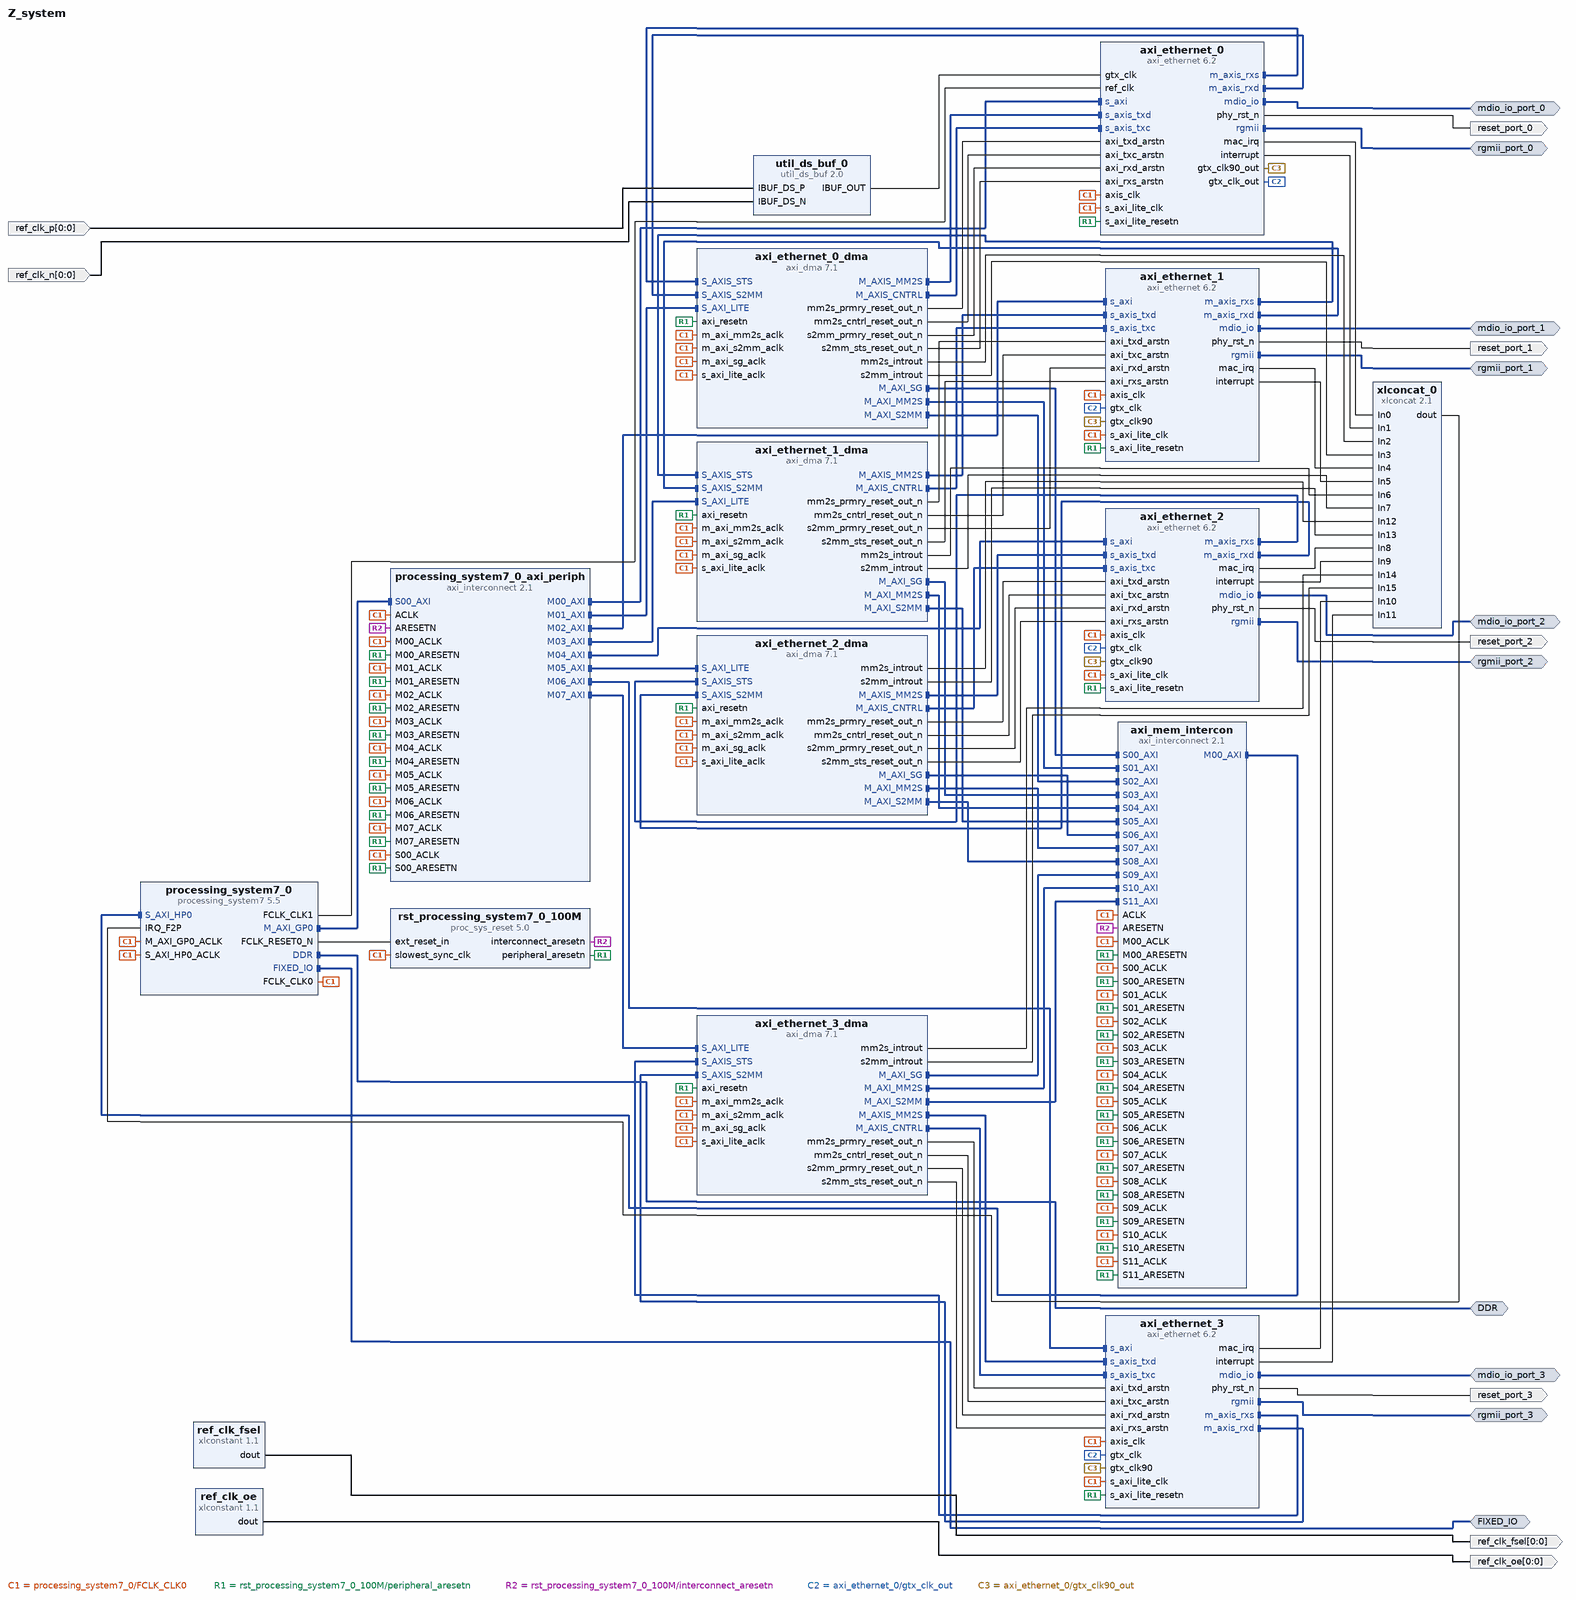
[diagram p0: block diagram of the top level]
# Vivado block design Z_system, Vivado 2014.4
create_bd_design Z_system

create_bd_intf_port -mode Master -vlnv xilinx.com:interface:ddrx_rtl:1.0 DDR
create_bd_intf_port -mode Master -vlnv xilinx.com:display_processing_system7:fixedio_rtl:1.0 FIXED_IO
create_bd_intf_port -mode Master -vlnv xilinx.com:interface:mdio_io:1.0 mdio_io_port_0
create_bd_intf_port -mode Master -vlnv xilinx.com:interface:rgmii_rtl:1.0 rgmii_port_0
create_bd_intf_port -mode Master -vlnv xilinx.com:interface:mdio_io:1.0 mdio_io_port_1
create_bd_intf_port -mode Master -vlnv xilinx.com:interface:rgmii_rtl:1.0 rgmii_port_1
create_bd_intf_port -mode Master -vlnv xilinx.com:interface:mdio_io:1.0 mdio_io_port_2
create_bd_intf_port -mode Master -vlnv xilinx.com:interface:rgmii_rtl:1.0 rgmii_port_2
create_bd_intf_port -mode Master -vlnv xilinx.com:interface:mdio_io:1.0 mdio_io_port_3
create_bd_intf_port -mode Master -vlnv xilinx.com:interface:rgmii_rtl:1.0 rgmii_port_3
create_bd_port -dir I -from 0 -to 0 ref_clk_p
create_bd_port -dir I -from 0 -to 0 ref_clk_n
create_bd_port -dir O -from 0 -to 0 ref_clk_fsel
create_bd_port -dir O -from 0 -to 0 ref_clk_oe
create_bd_port -dir O -type rst reset_port_0
create_bd_port -dir O -type rst reset_port_1
create_bd_port -dir O -type rst reset_port_2
create_bd_port -dir O -type rst reset_port_3

create_bd_cell -type ip -vlnv xilinx.com:ip:util_ds_buf:2.0 util_ds_buf_0
create_bd_cell -type ip -vlnv xilinx.com:ip:xlconstant:1.1 ref_clk_fsel
create_bd_cell -type ip -vlnv xilinx.com:ip:xlconstant:1.1 ref_clk_oe
create_bd_cell -type ip -vlnv xilinx.com:ip:processing_system7:5.5 processing_system7_0
set_property -dict [list \
  CONFIG.PCW_FPGA0_PERIPHERAL_FREQMHZ 100 \
  CONFIG.PCW_FPGA1_PERIPHERAL_FREQMHZ 200 \
  CONFIG.PCW_USE_S_AXI_HP0 1 \
  CONFIG.PCW_USE_FABRIC_INTERRUPT 1 \
  CONFIG.PCW_EN_CLK1_PORT 1 \
  CONFIG.PCW_IRQ_F2P_INTR 1 \
  CONFIG.preset {ZC706*} \
] [get_bd_cells processing_system7_0]
# 1 more settings of processing_system7_0 are not shown: defaults, MIO pin electricals, DDR timing, and values the tool derives
create_bd_cell -type ip -vlnv xilinx.com:ip:axi_ethernet:6.2 axi_ethernet_0
set_property -dict [list \
  CONFIG.USE_BOARD_FLOW true \
  CONFIG.PHY_TYPE RGMII \
  CONFIG.PHYRST_BOARD_INTERFACE Custom \
] [get_bd_cells axi_ethernet_0]
create_bd_cell -type ip -vlnv xilinx.com:ip:axi_dma:7.1 axi_ethernet_0_dma
set_property -dict [list \
  CONFIG.c_sg_length_width 16 \
  CONFIG.c_include_mm2s_dre 1 \
  CONFIG.c_sg_use_stsapp_length 1 \
  CONFIG.c_include_s2mm_dre 1 \
] [get_bd_cells axi_ethernet_0_dma]
create_bd_cell -type ip -vlnv xilinx.com:ip:axi_interconnect:2.1 axi_mem_intercon
set_property -dict {CONFIG.NUM_SI 12 CONFIG.NUM_MI 1} [get_bd_cells axi_mem_intercon]
create_bd_cell -type ip -vlnv xilinx.com:ip:proc_sys_reset:5.0 rst_processing_system7_0_100M
create_bd_cell -type ip -vlnv xilinx.com:ip:axi_interconnect:2.1 processing_system7_0_axi_periph
set_property -dict {CONFIG.NUM_MI 8} [get_bd_cells processing_system7_0_axi_periph]
create_bd_cell -type ip -vlnv xilinx.com:ip:axi_ethernet:6.2 axi_ethernet_1
set_property -dict [list \
  CONFIG.USE_BOARD_FLOW true \
  CONFIG.PHY_TYPE RGMII \
  CONFIG.PHYRST_BOARD_INTERFACE Custom \
  CONFIG.SupportLevel 0 \
] [get_bd_cells axi_ethernet_1]
create_bd_cell -type ip -vlnv xilinx.com:ip:axi_dma:7.1 axi_ethernet_1_dma
set_property -dict [list \
  CONFIG.c_sg_length_width 16 \
  CONFIG.c_include_mm2s_dre 1 \
  CONFIG.c_sg_use_stsapp_length 1 \
  CONFIG.c_include_s2mm_dre 1 \
] [get_bd_cells axi_ethernet_1_dma]
create_bd_cell -type ip -vlnv xilinx.com:ip:axi_ethernet:6.2 axi_ethernet_2
set_property -dict [list \
  CONFIG.USE_BOARD_FLOW true \
  CONFIG.PHY_TYPE RGMII \
  CONFIG.PHYRST_BOARD_INTERFACE Custom \
  CONFIG.SupportLevel 0 \
] [get_bd_cells axi_ethernet_2]
create_bd_cell -type ip -vlnv xilinx.com:ip:axi_dma:7.1 axi_ethernet_2_dma
set_property -dict [list \
  CONFIG.c_sg_length_width 16 \
  CONFIG.c_include_mm2s_dre 1 \
  CONFIG.c_sg_use_stsapp_length 1 \
  CONFIG.c_include_s2mm_dre 1 \
] [get_bd_cells axi_ethernet_2_dma]
create_bd_cell -type ip -vlnv xilinx.com:ip:axi_ethernet:6.2 axi_ethernet_3
set_property -dict [list \
  CONFIG.USE_BOARD_FLOW true \
  CONFIG.PHY_TYPE RGMII \
  CONFIG.PHYRST_BOARD_INTERFACE Custom \
  CONFIG.SupportLevel 0 \
] [get_bd_cells axi_ethernet_3]
create_bd_cell -type ip -vlnv xilinx.com:ip:axi_dma:7.1 axi_ethernet_3_dma
set_property -dict [list \
  CONFIG.c_sg_length_width 16 \
  CONFIG.c_include_mm2s_dre 1 \
  CONFIG.c_sg_use_stsapp_length 1 \
  CONFIG.c_include_s2mm_dre 1 \
] [get_bd_cells axi_ethernet_3_dma]
create_bd_cell -type ip -vlnv xilinx.com:ip:xlconcat:2.1 xlconcat_0
set_property -dict {CONFIG.NUM_PORTS 16} [get_bd_cells xlconcat_0]

# ---- connections ----

connect_bd_intf_net [get_bd_intf_pins axi_ethernet_0_dma/M_AXIS_MM2S] [get_bd_intf_pins axi_ethernet_0/s_axis_txd]
connect_bd_intf_net [get_bd_intf_pins axi_ethernet_0_dma/M_AXIS_CNTRL] [get_bd_intf_pins axi_ethernet_0/s_axis_txc]
connect_bd_intf_net [get_bd_intf_pins axi_ethernet_0_dma/S_AXIS_STS] [get_bd_intf_pins axi_ethernet_0/m_axis_rxs]
connect_bd_intf_net [get_bd_intf_pins axi_ethernet_0_dma/S_AXIS_S2MM] [get_bd_intf_pins axi_ethernet_0/m_axis_rxd]
connect_bd_intf_net [get_bd_intf_pins axi_ethernet_0_dma/M_AXI_SG] [get_bd_intf_pins axi_mem_intercon/S00_AXI]
connect_bd_intf_net [get_bd_intf_pins axi_mem_intercon/M00_AXI] [get_bd_intf_pins processing_system7_0/S_AXI_HP0]
connect_bd_intf_net [get_bd_intf_pins processing_system7_0/M_AXI_GP0] [get_bd_intf_pins processing_system7_0_axi_periph/S00_AXI]
connect_bd_intf_net [get_bd_intf_pins processing_system7_0_axi_periph/M00_AXI] [get_bd_intf_pins axi_ethernet_0/s_axi]
connect_bd_intf_net [get_bd_intf_pins processing_system7_0_axi_periph/M01_AXI] [get_bd_intf_pins axi_ethernet_0_dma/S_AXI_LITE]
connect_bd_intf_net [get_bd_intf_pins axi_ethernet_0_dma/M_AXI_MM2S] [get_bd_intf_pins axi_mem_intercon/S01_AXI]
connect_bd_intf_net [get_bd_intf_pins axi_ethernet_0_dma/M_AXI_S2MM] [get_bd_intf_pins axi_mem_intercon/S02_AXI]
connect_bd_intf_net [get_bd_intf_pins axi_ethernet_1_dma/M_AXIS_MM2S] [get_bd_intf_pins axi_ethernet_1/s_axis_txd]
connect_bd_intf_net [get_bd_intf_pins axi_ethernet_1_dma/M_AXIS_CNTRL] [get_bd_intf_pins axi_ethernet_1/s_axis_txc]
connect_bd_intf_net [get_bd_intf_pins axi_ethernet_1_dma/S_AXIS_STS] [get_bd_intf_pins axi_ethernet_1/m_axis_rxs]
connect_bd_intf_net [get_bd_intf_pins axi_ethernet_1_dma/S_AXIS_S2MM] [get_bd_intf_pins axi_ethernet_1/m_axis_rxd]
connect_bd_intf_net [get_bd_intf_pins processing_system7_0_axi_periph/M02_AXI] [get_bd_intf_pins axi_ethernet_1/s_axi]
connect_bd_intf_net [get_bd_intf_pins processing_system7_0_axi_periph/M03_AXI] [get_bd_intf_pins axi_ethernet_1_dma/S_AXI_LITE]
connect_bd_intf_net [get_bd_intf_pins axi_ethernet_1_dma/M_AXI_SG] [get_bd_intf_pins axi_mem_intercon/S03_AXI]
connect_bd_intf_net [get_bd_intf_pins axi_ethernet_1_dma/M_AXI_MM2S] [get_bd_intf_pins axi_mem_intercon/S04_AXI]
connect_bd_intf_net [get_bd_intf_pins axi_ethernet_1_dma/M_AXI_S2MM] [get_bd_intf_pins axi_mem_intercon/S05_AXI]
connect_bd_intf_net [get_bd_intf_pins axi_ethernet_2_dma/M_AXIS_MM2S] [get_bd_intf_pins axi_ethernet_2/s_axis_txd]
connect_bd_intf_net [get_bd_intf_pins axi_ethernet_2_dma/M_AXIS_CNTRL] [get_bd_intf_pins axi_ethernet_2/s_axis_txc]
connect_bd_intf_net [get_bd_intf_pins axi_ethernet_2_dma/S_AXIS_STS] [get_bd_intf_pins axi_ethernet_2/m_axis_rxs]
connect_bd_intf_net [get_bd_intf_pins axi_ethernet_2_dma/S_AXIS_S2MM] [get_bd_intf_pins axi_ethernet_2/m_axis_rxd]
connect_bd_intf_net [get_bd_intf_pins processing_system7_0_axi_periph/M04_AXI] [get_bd_intf_pins axi_ethernet_2/s_axi]
connect_bd_intf_net [get_bd_intf_pins processing_system7_0_axi_periph/M05_AXI] [get_bd_intf_pins axi_ethernet_2_dma/S_AXI_LITE]
connect_bd_intf_net [get_bd_intf_pins axi_ethernet_2_dma/M_AXI_SG] [get_bd_intf_pins axi_mem_intercon/S06_AXI]
connect_bd_intf_net [get_bd_intf_pins axi_ethernet_2_dma/M_AXI_MM2S] [get_bd_intf_pins axi_mem_intercon/S07_AXI]
connect_bd_intf_net [get_bd_intf_pins axi_ethernet_2_dma/M_AXI_S2MM] [get_bd_intf_pins axi_mem_intercon/S08_AXI]
connect_bd_intf_net [get_bd_intf_pins axi_ethernet_3_dma/M_AXIS_MM2S] [get_bd_intf_pins axi_ethernet_3/s_axis_txd]
connect_bd_intf_net [get_bd_intf_pins axi_ethernet_3_dma/M_AXIS_CNTRL] [get_bd_intf_pins axi_ethernet_3/s_axis_txc]
connect_bd_intf_net [get_bd_intf_pins axi_ethernet_3_dma/S_AXIS_STS] [get_bd_intf_pins axi_ethernet_3/m_axis_rxs]
connect_bd_intf_net [get_bd_intf_pins axi_ethernet_3_dma/S_AXIS_S2MM] [get_bd_intf_pins axi_ethernet_3/m_axis_rxd]
connect_bd_intf_net [get_bd_intf_pins processing_system7_0_axi_periph/M06_AXI] [get_bd_intf_pins axi_ethernet_3/s_axi]
connect_bd_intf_net [get_bd_intf_pins processing_system7_0_axi_periph/M07_AXI] [get_bd_intf_pins axi_ethernet_3_dma/S_AXI_LITE]
connect_bd_intf_net [get_bd_intf_pins axi_ethernet_3_dma/M_AXI_SG] [get_bd_intf_pins axi_mem_intercon/S09_AXI]
connect_bd_intf_net [get_bd_intf_pins axi_ethernet_3_dma/M_AXI_MM2S] [get_bd_intf_pins axi_mem_intercon/S10_AXI]
connect_bd_intf_net [get_bd_intf_pins axi_ethernet_3_dma/M_AXI_S2MM] [get_bd_intf_pins axi_mem_intercon/S11_AXI]
connect_bd_intf_net [get_bd_intf_ports DDR] [get_bd_intf_pins processing_system7_0/DDR]
connect_bd_intf_net [get_bd_intf_ports FIXED_IO] [get_bd_intf_pins processing_system7_0/FIXED_IO]
connect_bd_intf_net [get_bd_intf_ports mdio_io_port_0] [get_bd_intf_pins axi_ethernet_0/mdio_io]
connect_bd_intf_net [get_bd_intf_ports rgmii_port_0] [get_bd_intf_pins axi_ethernet_0/rgmii]
connect_bd_intf_net [get_bd_intf_ports mdio_io_port_1] [get_bd_intf_pins axi_ethernet_1/mdio_io]
connect_bd_intf_net [get_bd_intf_ports rgmii_port_1] [get_bd_intf_pins axi_ethernet_1/rgmii]
connect_bd_intf_net [get_bd_intf_ports mdio_io_port_2] [get_bd_intf_pins axi_ethernet_2/mdio_io]
connect_bd_intf_net [get_bd_intf_ports rgmii_port_2] [get_bd_intf_pins axi_ethernet_2/rgmii]
connect_bd_intf_net [get_bd_intf_ports mdio_io_port_3] [get_bd_intf_pins axi_ethernet_3/mdio_io]
connect_bd_intf_net [get_bd_intf_ports rgmii_port_3] [get_bd_intf_pins axi_ethernet_3/rgmii]
connect_bd_net [get_bd_ports ref_clk_p] [get_bd_pins util_ds_buf_0/IBUF_DS_P]
connect_bd_net [get_bd_ports ref_clk_n] [get_bd_pins util_ds_buf_0/IBUF_DS_N]
connect_bd_net [get_bd_pins ref_clk_fsel/dout] [get_bd_ports ref_clk_fsel]
connect_bd_net [get_bd_pins ref_clk_oe/dout] [get_bd_ports ref_clk_oe]
connect_bd_net [get_bd_pins axi_ethernet_0_dma/mm2s_prmry_reset_out_n] [get_bd_pins axi_ethernet_0/axi_txd_arstn]
connect_bd_net [get_bd_pins axi_ethernet_0_dma/mm2s_cntrl_reset_out_n] [get_bd_pins axi_ethernet_0/axi_txc_arstn]
connect_bd_net [get_bd_pins axi_ethernet_0_dma/s2mm_prmry_reset_out_n] [get_bd_pins axi_ethernet_0/axi_rxd_arstn]
connect_bd_net [get_bd_pins axi_ethernet_0_dma/s2mm_sts_reset_out_n] [get_bd_pins axi_ethernet_0/axi_rxs_arstn]
connect_bd_net [get_bd_pins processing_system7_0/FCLK_CLK0] \
  [get_bd_pins axi_ethernet_0_dma/m_axi_sg_aclk] [get_bd_pins axi_mem_intercon/S00_ACLK] \
  [get_bd_pins rst_processing_system7_0_100M/slowest_sync_clk] [get_bd_pins axi_mem_intercon/ACLK] \
  [get_bd_pins processing_system7_0/S_AXI_HP0_ACLK] [get_bd_pins axi_mem_intercon/M00_ACLK] \
  [get_bd_pins processing_system7_0/M_AXI_GP0_ACLK] [get_bd_pins processing_system7_0_axi_periph/S00_ACLK] \
  [get_bd_pins processing_system7_0_axi_periph/ACLK] [get_bd_pins axi_ethernet_0/s_axi_lite_clk] \
  [get_bd_pins processing_system7_0_axi_periph/M00_ACLK] [get_bd_pins axi_ethernet_0_dma/s_axi_lite_aclk] \
  [get_bd_pins processing_system7_0_axi_periph/M01_ACLK] [get_bd_pins axi_ethernet_0_dma/m_axi_mm2s_aclk] \
  [get_bd_pins axi_ethernet_0_dma/m_axi_s2mm_aclk] [get_bd_pins axi_ethernet_0/axis_clk] \
  [get_bd_pins axi_mem_intercon/S01_ACLK] [get_bd_pins axi_mem_intercon/S02_ACLK] [get_bd_pins axi_ethernet_1/s_axi_lite_clk] \
  [get_bd_pins processing_system7_0_axi_periph/M02_ACLK] [get_bd_pins axi_ethernet_1_dma/s_axi_lite_aclk] \
  [get_bd_pins processing_system7_0_axi_periph/M03_ACLK] [get_bd_pins axi_ethernet_1_dma/m_axi_sg_aclk] \
  [get_bd_pins axi_mem_intercon/S03_ACLK] [get_bd_pins axi_ethernet_1_dma/m_axi_mm2s_aclk] \
  [get_bd_pins axi_ethernet_1_dma/m_axi_s2mm_aclk] [get_bd_pins axi_ethernet_1/axis_clk] \
  [get_bd_pins axi_mem_intercon/S04_ACLK] [get_bd_pins axi_mem_intercon/S05_ACLK] [get_bd_pins axi_ethernet_2/s_axi_lite_clk] \
  [get_bd_pins processing_system7_0_axi_periph/M04_ACLK] [get_bd_pins axi_ethernet_2_dma/s_axi_lite_aclk] \
  [get_bd_pins processing_system7_0_axi_periph/M05_ACLK] [get_bd_pins axi_ethernet_2_dma/m_axi_sg_aclk] \
  [get_bd_pins axi_mem_intercon/S06_ACLK] [get_bd_pins axi_ethernet_2_dma/m_axi_mm2s_aclk] \
  [get_bd_pins axi_ethernet_2_dma/m_axi_s2mm_aclk] [get_bd_pins axi_ethernet_2/axis_clk] \
  [get_bd_pins axi_mem_intercon/S07_ACLK] [get_bd_pins axi_mem_intercon/S08_ACLK] [get_bd_pins axi_ethernet_3/s_axi_lite_clk] \
  [get_bd_pins processing_system7_0_axi_periph/M06_ACLK] [get_bd_pins axi_ethernet_3_dma/s_axi_lite_aclk] \
  [get_bd_pins processing_system7_0_axi_periph/M07_ACLK] [get_bd_pins axi_ethernet_3_dma/m_axi_sg_aclk] \
  [get_bd_pins axi_mem_intercon/S09_ACLK] [get_bd_pins axi_ethernet_3_dma/m_axi_mm2s_aclk] \
  [get_bd_pins axi_ethernet_3_dma/m_axi_s2mm_aclk] [get_bd_pins axi_ethernet_3/axis_clk] \
  [get_bd_pins axi_mem_intercon/S10_ACLK] [get_bd_pins axi_mem_intercon/S11_ACLK]
connect_bd_net [get_bd_pins processing_system7_0/FCLK_RESET0_N] [get_bd_pins rst_processing_system7_0_100M/ext_reset_in]
connect_bd_net [get_bd_pins rst_processing_system7_0_100M/peripheral_aresetn] \
  [get_bd_pins axi_mem_intercon/S00_ARESETN] [get_bd_pins axi_mem_intercon/M00_ARESETN] \
  [get_bd_pins processing_system7_0_axi_periph/S00_ARESETN] [get_bd_pins axi_ethernet_0/s_axi_lite_resetn] \
  [get_bd_pins processing_system7_0_axi_periph/M00_ARESETN] [get_bd_pins axi_ethernet_0_dma/axi_resetn] \
  [get_bd_pins processing_system7_0_axi_periph/M01_ARESETN] [get_bd_pins axi_mem_intercon/S01_ARESETN] \
  [get_bd_pins axi_mem_intercon/S02_ARESETN] [get_bd_pins axi_ethernet_1/s_axi_lite_resetn] \
  [get_bd_pins processing_system7_0_axi_periph/M02_ARESETN] [get_bd_pins axi_ethernet_1_dma/axi_resetn] \
  [get_bd_pins processing_system7_0_axi_periph/M03_ARESETN] [get_bd_pins axi_mem_intercon/S03_ARESETN] \
  [get_bd_pins axi_mem_intercon/S04_ARESETN] [get_bd_pins axi_mem_intercon/S05_ARESETN] \
  [get_bd_pins axi_ethernet_2/s_axi_lite_resetn] [get_bd_pins processing_system7_0_axi_periph/M04_ARESETN] \
  [get_bd_pins axi_ethernet_2_dma/axi_resetn] [get_bd_pins processing_system7_0_axi_periph/M05_ARESETN] \
  [get_bd_pins axi_mem_intercon/S06_ARESETN] [get_bd_pins axi_mem_intercon/S07_ARESETN] \
  [get_bd_pins axi_mem_intercon/S08_ARESETN] [get_bd_pins axi_ethernet_3/s_axi_lite_resetn] \
  [get_bd_pins processing_system7_0_axi_periph/M06_ARESETN] [get_bd_pins axi_ethernet_3_dma/axi_resetn] \
  [get_bd_pins processing_system7_0_axi_periph/M07_ARESETN] [get_bd_pins axi_mem_intercon/S09_ARESETN] \
  [get_bd_pins axi_mem_intercon/S10_ARESETN] [get_bd_pins axi_mem_intercon/S11_ARESETN]
connect_bd_net [get_bd_pins rst_processing_system7_0_100M/interconnect_aresetn] \
  [get_bd_pins axi_mem_intercon/ARESETN] [get_bd_pins processing_system7_0_axi_periph/ARESETN]
connect_bd_net [get_bd_pins axi_ethernet_0/phy_rst_n] [get_bd_ports reset_port_0]
connect_bd_net [get_bd_pins axi_ethernet_1_dma/mm2s_prmry_reset_out_n] [get_bd_pins axi_ethernet_1/axi_txd_arstn]
connect_bd_net [get_bd_pins axi_ethernet_1_dma/mm2s_cntrl_reset_out_n] [get_bd_pins axi_ethernet_1/axi_txc_arstn]
connect_bd_net [get_bd_pins axi_ethernet_1_dma/s2mm_prmry_reset_out_n] [get_bd_pins axi_ethernet_1/axi_rxd_arstn]
connect_bd_net [get_bd_pins axi_ethernet_1_dma/s2mm_sts_reset_out_n] [get_bd_pins axi_ethernet_1/axi_rxs_arstn]
connect_bd_net [get_bd_pins axi_ethernet_1/phy_rst_n] [get_bd_ports reset_port_1]
connect_bd_net [get_bd_pins axi_ethernet_2_dma/mm2s_prmry_reset_out_n] [get_bd_pins axi_ethernet_2/axi_txd_arstn]
connect_bd_net [get_bd_pins axi_ethernet_2_dma/mm2s_cntrl_reset_out_n] [get_bd_pins axi_ethernet_2/axi_txc_arstn]
connect_bd_net [get_bd_pins axi_ethernet_2_dma/s2mm_prmry_reset_out_n] [get_bd_pins axi_ethernet_2/axi_rxd_arstn]
connect_bd_net [get_bd_pins axi_ethernet_2_dma/s2mm_sts_reset_out_n] [get_bd_pins axi_ethernet_2/axi_rxs_arstn]
connect_bd_net [get_bd_pins axi_ethernet_2/phy_rst_n] [get_bd_ports reset_port_2]
connect_bd_net [get_bd_pins axi_ethernet_3_dma/mm2s_prmry_reset_out_n] [get_bd_pins axi_ethernet_3/axi_txd_arstn]
connect_bd_net [get_bd_pins axi_ethernet_3_dma/mm2s_cntrl_reset_out_n] [get_bd_pins axi_ethernet_3/axi_txc_arstn]
connect_bd_net [get_bd_pins axi_ethernet_3_dma/s2mm_prmry_reset_out_n] [get_bd_pins axi_ethernet_3/axi_rxd_arstn]
connect_bd_net [get_bd_pins axi_ethernet_3_dma/s2mm_sts_reset_out_n] [get_bd_pins axi_ethernet_3/axi_rxs_arstn]
connect_bd_net [get_bd_pins axi_ethernet_3/phy_rst_n] [get_bd_ports reset_port_3]
connect_bd_net [get_bd_pins util_ds_buf_0/IBUF_OUT] [get_bd_pins axi_ethernet_0/gtx_clk]
connect_bd_net [get_bd_pins processing_system7_0/FCLK_CLK1] [get_bd_pins axi_ethernet_0/ref_clk]
connect_bd_net [get_bd_pins axi_ethernet_0/gtx_clk_out] \
  [get_bd_pins axi_ethernet_1/gtx_clk] [get_bd_pins axi_ethernet_2/gtx_clk] [get_bd_pins axi_ethernet_3/gtx_clk]
connect_bd_net [get_bd_pins axi_ethernet_0/gtx_clk90_out] \
  [get_bd_pins axi_ethernet_1/gtx_clk90] [get_bd_pins axi_ethernet_2/gtx_clk90] [get_bd_pins axi_ethernet_3/gtx_clk90]
connect_bd_net [get_bd_pins axi_ethernet_0/mac_irq] [get_bd_pins xlconcat_0/In0]
connect_bd_net [get_bd_pins axi_ethernet_0/interrupt] [get_bd_pins xlconcat_0/In1]
connect_bd_net [get_bd_pins axi_ethernet_0_dma/mm2s_introut] [get_bd_pins xlconcat_0/In2]
connect_bd_net [get_bd_pins axi_ethernet_0_dma/s2mm_introut] [get_bd_pins xlconcat_0/In3]
connect_bd_net [get_bd_pins axi_ethernet_1/mac_irq] [get_bd_pins xlconcat_0/In4]
connect_bd_net [get_bd_pins axi_ethernet_1/interrupt] [get_bd_pins xlconcat_0/In5]
connect_bd_net [get_bd_pins axi_ethernet_1_dma/mm2s_introut] [get_bd_pins xlconcat_0/In6]
connect_bd_net [get_bd_pins axi_ethernet_1_dma/s2mm_introut] [get_bd_pins xlconcat_0/In7]
connect_bd_net [get_bd_pins axi_ethernet_2/mac_irq] [get_bd_pins xlconcat_0/In8]
connect_bd_net [get_bd_pins axi_ethernet_2/interrupt] [get_bd_pins xlconcat_0/In9]
connect_bd_net [get_bd_pins axi_ethernet_3/mac_irq] [get_bd_pins xlconcat_0/In10]
connect_bd_net [get_bd_pins axi_ethernet_3/interrupt] [get_bd_pins xlconcat_0/In11]
connect_bd_net [get_bd_pins axi_ethernet_2_dma/mm2s_introut] [get_bd_pins xlconcat_0/In12]
connect_bd_net [get_bd_pins axi_ethernet_2_dma/s2mm_introut] [get_bd_pins xlconcat_0/In13]
connect_bd_net [get_bd_pins axi_ethernet_3_dma/mm2s_introut] [get_bd_pins xlconcat_0/In14]
connect_bd_net [get_bd_pins axi_ethernet_3_dma/s2mm_introut] [get_bd_pins xlconcat_0/In15]
connect_bd_net [get_bd_pins xlconcat_0/dout] [get_bd_pins processing_system7_0/IRQ_F2P]

# ---- address map ----
assign_bd_address -offset 0x0 -range 1G -target_address_space [get_bd_addr_spaces axi_ethernet_0_dma/Data_MM2S] [get_bd_addr_segs processing_system7_0/S_AXI_HP0/HP0_DDR_LOWOCM]
assign_bd_address -offset 0x0 -range 1G -target_address_space [get_bd_addr_spaces axi_ethernet_0_dma/Data_S2MM] [get_bd_addr_segs processing_system7_0/S_AXI_HP0/HP0_DDR_LOWOCM]
assign_bd_address -offset 0x0 -range 1G -target_address_space [get_bd_addr_spaces axi_ethernet_0_dma/Data_SG] [get_bd_addr_segs processing_system7_0/S_AXI_HP0/HP0_DDR_LOWOCM]
assign_bd_address -offset 0x0 -range 1G -target_address_space [get_bd_addr_spaces axi_ethernet_1_dma/Data_MM2S] [get_bd_addr_segs processing_system7_0/S_AXI_HP0/HP0_DDR_LOWOCM]
assign_bd_address -offset 0x0 -range 1G -target_address_space [get_bd_addr_spaces axi_ethernet_1_dma/Data_S2MM] [get_bd_addr_segs processing_system7_0/S_AXI_HP0/HP0_DDR_LOWOCM]
assign_bd_address -offset 0x0 -range 1G -target_address_space [get_bd_addr_spaces axi_ethernet_1_dma/Data_SG] [get_bd_addr_segs processing_system7_0/S_AXI_HP0/HP0_DDR_LOWOCM]
assign_bd_address -offset 0x0 -range 1G -target_address_space [get_bd_addr_spaces axi_ethernet_2_dma/Data_MM2S] [get_bd_addr_segs processing_system7_0/S_AXI_HP0/HP0_DDR_LOWOCM]
assign_bd_address -offset 0x0 -range 1G -target_address_space [get_bd_addr_spaces axi_ethernet_2_dma/Data_S2MM] [get_bd_addr_segs processing_system7_0/S_AXI_HP0/HP0_DDR_LOWOCM]
assign_bd_address -offset 0x0 -range 1G -target_address_space [get_bd_addr_spaces axi_ethernet_2_dma/Data_SG] [get_bd_addr_segs processing_system7_0/S_AXI_HP0/HP0_DDR_LOWOCM]
assign_bd_address -offset 0x0 -range 1G -target_address_space [get_bd_addr_spaces axi_ethernet_3_dma/Data_MM2S] [get_bd_addr_segs processing_system7_0/S_AXI_HP0/HP0_DDR_LOWOCM]
assign_bd_address -offset 0x0 -range 1G -target_address_space [get_bd_addr_spaces axi_ethernet_3_dma/Data_S2MM] [get_bd_addr_segs processing_system7_0/S_AXI_HP0/HP0_DDR_LOWOCM]
assign_bd_address -offset 0x0 -range 1G -target_address_space [get_bd_addr_spaces axi_ethernet_3_dma/Data_SG] [get_bd_addr_segs processing_system7_0/S_AXI_HP0/HP0_DDR_LOWOCM]
assign_bd_address -offset 0x40400000 -range 64K -target_address_space [get_bd_addr_spaces processing_system7_0/Data] [get_bd_addr_segs axi_ethernet_0_dma/S_AXI_LITE/Reg]
assign_bd_address -offset 0x40410000 -range 64K -target_address_space [get_bd_addr_spaces processing_system7_0/Data] [get_bd_addr_segs axi_ethernet_1_dma/S_AXI_LITE/Reg]
assign_bd_address -offset 0x40420000 -range 64K -target_address_space [get_bd_addr_spaces processing_system7_0/Data] [get_bd_addr_segs axi_ethernet_2_dma/S_AXI_LITE/Reg]
assign_bd_address -offset 0x40430000 -range 64K -target_address_space [get_bd_addr_spaces processing_system7_0/Data] [get_bd_addr_segs axi_ethernet_3_dma/S_AXI_LITE/Reg]
assign_bd_address -offset 0x41000000 -range 256K -target_address_space [get_bd_addr_spaces processing_system7_0/Data] [get_bd_addr_segs axi_ethernet_0/s_axi/Reg]
assign_bd_address -offset 0x41040000 -range 256K -target_address_space [get_bd_addr_spaces processing_system7_0/Data] [get_bd_addr_segs axi_ethernet_1/s_axi/Reg]
assign_bd_address -offset 0x41080000 -range 256K -target_address_space [get_bd_addr_spaces processing_system7_0/Data] [get_bd_addr_segs axi_ethernet_2/s_axi/Reg]
assign_bd_address -offset 0x410C0000 -range 256K -target_address_space [get_bd_addr_spaces processing_system7_0/Data] [get_bd_addr_segs axi_ethernet_3/s_axi/Reg]

validate_bd_design
save_bd_design
